# EAGLE design TestAirPollutionFinal (EAGLE 9.6.2)
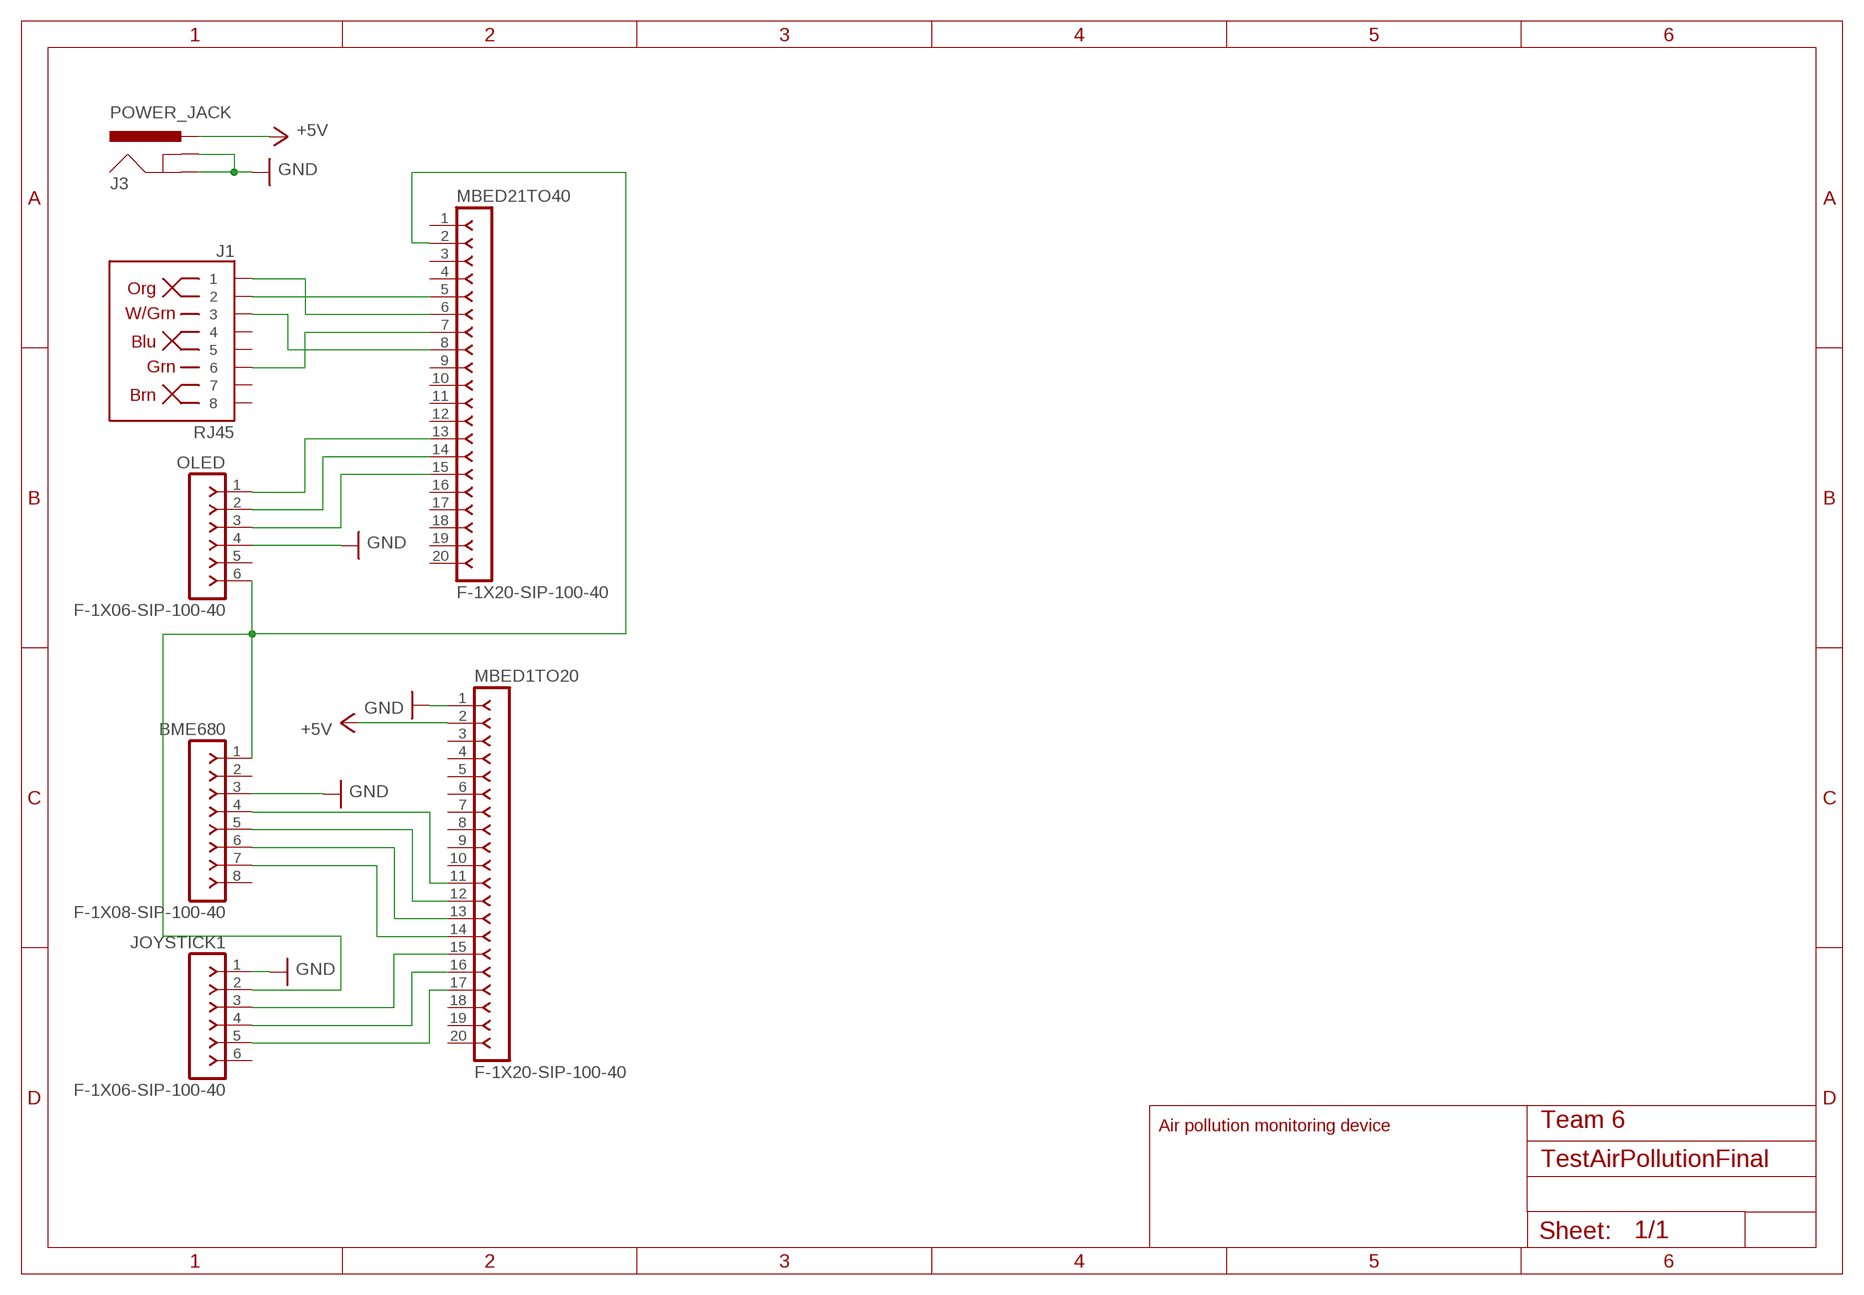
[diagram p0: schematic, sheet 1]

## Parts
BME680  F-1X08-SIP-100-40  [SIP-100-08-40]
J1  RJ45  RJ45-8  [RJ45-8]
J3  POWER_JACK  [POWER_JACK_PTH]
JOYSTICK1  F-1X06-SIP-100-40  [SIP-100-06-40]
MBED1TO20  F-1X20-SIP-100-40  [SIP-100-20-40]
MBED21TO40  F-1X20-SIP-100-40  [SIP-100-20-40]
OLED  F-1X06-SIP-100-40  [SIP-100-06-40]

## Nets
+5V: J3.PWR MBED1TO20.2
CS: BME680.7 MBED1TO20.14
GND: BME680.3 J3.GND J3.GNDBREAK JOYSTICK1.1 MBED1TO20.1 OLED.4
RD+: J1.1 MBED21TO40.6
RD-: J1.2 MBED21TO40.5
RESET: MBED21TO40.15 OLED.3
SCK: BME680.4 MBED1TO20.11
SCLP27: MBED21TO40.14 OLED.2
SDAP28: MBED21TO40.13 OLED.1
SDI: BME680.6 MBED1TO20.13
SDO: BME680.5 MBED1TO20.12
SW: JOYSTICK1.5 MBED1TO20.17
TD+: J1.3 MBED21TO40.8
TD-: J1.6 MBED21TO40.7
VRX: JOYSTICK1.3 MBED1TO20.15
VRY: JOYSTICK1.4 MBED1TO20.16
VU: BME680.1 JOYSTICK1.2 MBED21TO40.2 OLED.6
Unconnected: BME680.2 BME680.8 J1.4 J1.5 J1.7 J1.8 JOYSTICK1.6 MBED1TO20.3 MBED1TO20.4 MBED1TO20.5 MBED1TO20.6 MBED1TO20.7 MBED1TO20.8 MBED1TO20.9 MBED1TO20.10 MBED1TO20.18 MBED1TO20.19 MBED1TO20.20 MBED21TO40.1 MBED21TO40.3 MBED21TO40.4 MBED21TO40.9 MBED21TO40.10 MBED21TO40.11 MBED21TO40.12 MBED21TO40.16 MBED21TO40.17 MBED21TO40.18 MBED21TO40.19 MBED21TO40.20 OLED.5

## Notes on the sheet
- Air pollution monitoring device | Team 6

## Library data of the parts
BME680 = con-headers-jp:F-1X08-: FEMALE HEADER
J1 = SparkFun-Connectors:RJ45-8: RJ45 Jack - 8 pin Simple RJ45, 8-pin connection. Commonly used for Cat5, Cat5e, and Cat6 Ethernet cables. Here is the connector we sell at SparkFun: RJ45 8-Pin Connector <https://www.sparkfun.com/products/643> (PRT-00643) Datasheet <https://cdn.sparkfun.com/datasheets/Prototyping/04908.pdf> It is used on this SparkFun product: SparkFun RJ45 Breakout <https://www.sparkfun.com/products/716> (BOB-00716) Note, you may also be interested in the "MAGJACK" version of this. It is basically a RJ45 connector, but also has some status LEDs built into the connector housing. You can check that out in this library at the device named "MAGJACK.dev" and see these products online: RJ45 Ethernet MagJack-Compatible <https://www.sparkfun.com/products/8534> (PRT-08534) SparkFun RJ45 MagJack Breakout <https://www.sparkfun.com/products/13021> (BOB-13021); PROD_ID: CONN-08506; SF_ID: PRT-00643
J3 = SparkFun-Connectors:POWER_JACK: Power Jack Connector This is the standard 5.5mm barrel jack for power. The PTH is the most common, proven, reliable, footprint. The Slot footprint only works if the mill layer is transmitted to the PCB fab house so be warned. Here are the connectors we sell at SparkFun: DC Barrel Power Jack/Connector <https://www.sparkfun.com/products/119> (PRT-00119) DC Barrel Power Jack/Connector (SMD) <https://www.sparkfun.com/products/12748> (PRT-12748) DC Barrel Jack Adapter - Breadboard Compatible <https://www.sparkfun.com/products/10811> (PRT-10811) It is used on this SparkFun product (and many, many others): SparkFun RedBoard - Programmed with Arduino <https://www.sparkfun.com/products/12757> (DEV-12757) Also, if you need a mating power supply or connector, please check these out: Wall Adapter Power Supply - 9VDC 650mA <https://www.sparkfun.com/products/298> (TOL-00298) DC Barrel Jack Adapter - Male <https://www.sparkfun.com/products/10287> (PRT-10287); PROD_ID: CONN-08197
JOYSTICK1 OLED = con-headers-jp:F-1X06-: FEMALE HEADER
MBED1TO20 MBED21TO40 = con-headers-jp:F-1X20-: FEMALE HEADER

## Board
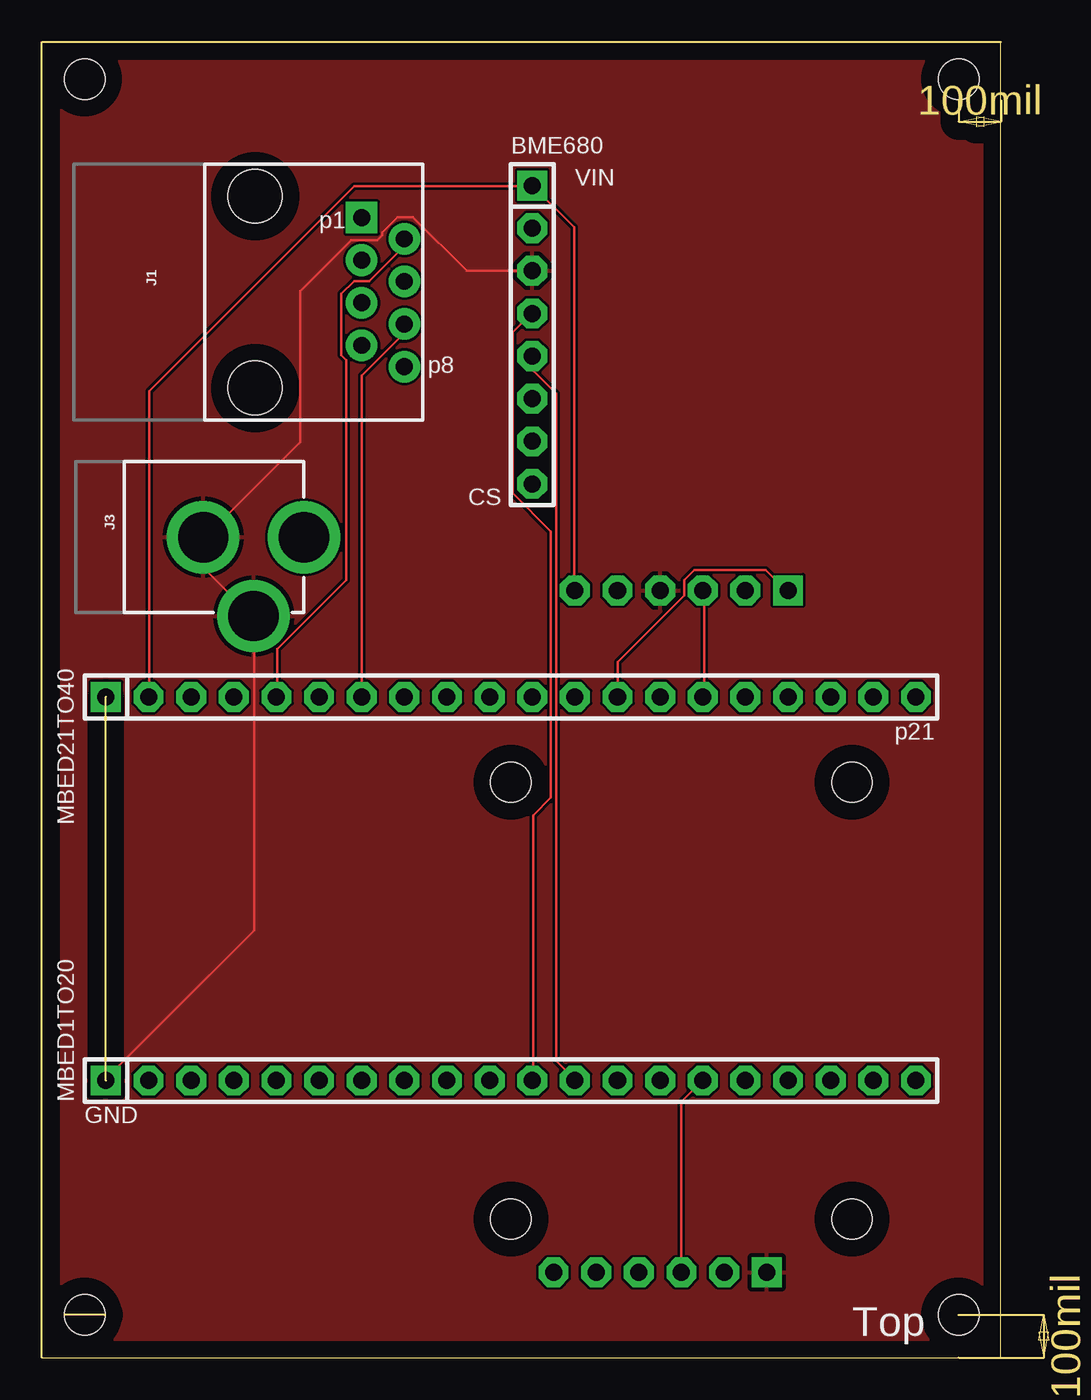
[diagram p1: board, top side]
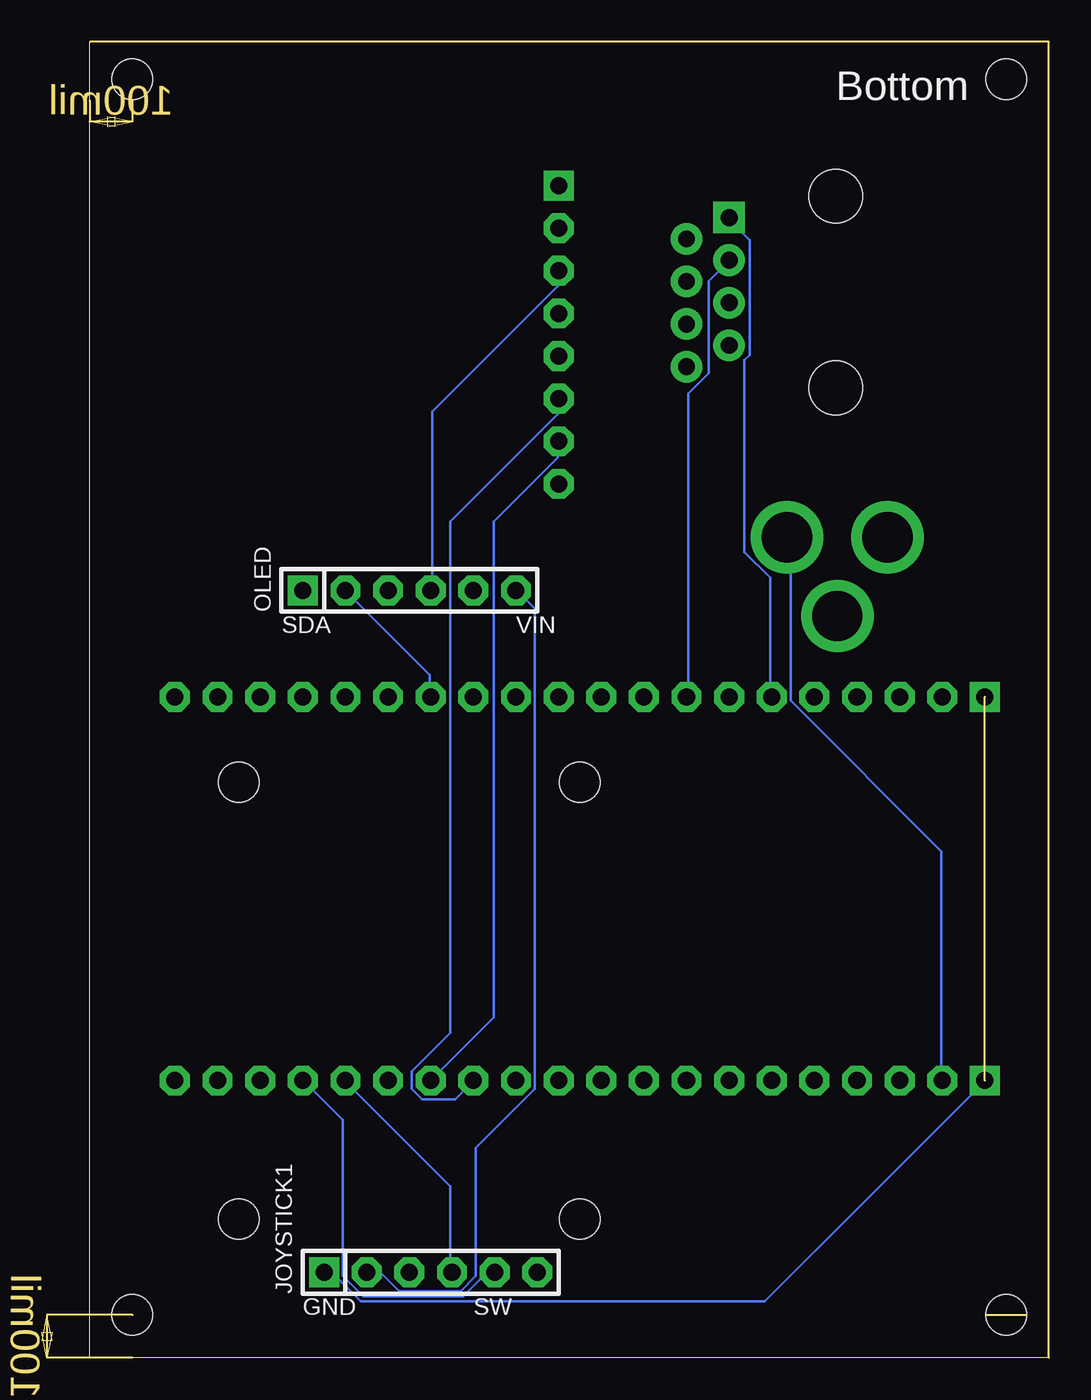
[diagram p2: board, bottom side, seen from below]

Size 57.13 x 78.41 mm. Coordinates in mm from the lower left corner, seen from the top.
Outline: 0,0 57.13,0 57.13,78.41 0,78.41 0,0
Copper layers (1*16): Top 0.035mm / dielectric 1.5mm / Bottom 0.035mm
Design rules "default": minimum track width 6mil, minimum drill 0.35mm, track to track 6mil, track to pad 6mil, pad to pad 6mil, via to via 6mil, smd to smd 6mil, copper to edge 40mil, drill to drill 6mil, minimum pad ring 10mil, minimum via ring 8mil, stop-mask expansion 4mil, vias tented up to drill 0mil, thermal gap 10mil
Holes 2.4 mm at 2.54,2.54 2.54,76.2 27.94,34.29 48.26,34.29 48.26,8.26 27.94,8.26 54.61,76.2 54.61,2.54

### Footprints (pad centres in the part's own frame; a part is rotated, then mirrored left to right if it is on the bottom)
SIP-100-08-40 = drill 1.016 pad 1.778 square: 1 -8.89,0 | drill 1.016 pad 1.778 octagon: 2 -6.35,0; 3 -3.81,0; 4 -1.27,0; 5 1.27,0; 6 3.81,0; 7 6.35,0; 8 8.89,0
RJ45-8 = drill 1 pad 1.88 square: 1 -4.445,6.35 | drill 1 pad 1.88: 2 -3.175,8.89; 3 -1.905,6.35; 4 -0.635,8.89; 5 0.635,6.35; 6 1.905,8.89; 7 3.175,6.35; 8 4.445,8.89 | hole 3.2: -5.715,0; 5.715,0
POWER_JACK_PTH = drill 2.997 pad 4.318: GND 0,7.7; GNDBREAK 4.7,10.7; PWR 0,13.7
SIP-100-06-40 = drill 1.016 pad 1.778 square: 1 -6.35,0 | drill 1.016 pad 1.778 octagon: 2 -3.81,0; 3 -1.27,0; 4 1.27,0; 5 3.81,0; 6 6.35,0
SIP-100-20-40 = drill 1.016 pad 1.778 square: 1 -24.13,0 | drill 1.016 pad 1.778 octagon: 2 -21.59,0; 3 -19.05,0; 4 -16.51,0; 5 -13.97,0; 6 -11.43,0; 7 -8.89,0; 8 -6.35,0; 9 -3.81,0; 10 -1.27,0; 11 1.27,0; 12 3.81,0; 13 6.35,0; 14 8.89,0; 15 11.43,0; 16 13.97,0; 17 16.51,0; 18 19.05,0; 19 21.59,0; 20 24.13,0

### Placement (x,y rotation side)
BME680  29.21,60.96 270 top
J1  12.7,63.5 270 top
J3  1.91,48.9 270 top
JOYSTICK1  36.83,5.08 0 bottom
MBED1TO20  27.94,16.51 0 top
MBED21TO40  27.94,39.37 0 top
OLED  38.1,45.72 0 bottom

### Tracks (layer width: path | path; a pad name or v marks a point on that pad's centre or on a via)
+5V
  Bottom 0.152: MBED1TO20.2 6.4,16.61 6.4,30.18 15.39,39.17 15.39,48.62 15.54,48.77 J3.PWR
CS
  Bottom 0.152: MBED1TO20.14 33.07,20.27 33.07,49.84 29.26,53.65 29.26,54.56 BME680.7
GND
  Top 0.152: MBED1TO20.1 3.81,16.61 12.65,25.45 12.65,44.04 J3.GNDBREAK 12.5,44.2 9.75,46.94 9.75,48.77 J3.GND 9.75,48.92 15.39,54.56 15.39,63.55 18.44,66.6 19.96,66.6 20.27,66.9 20.27,67.06 21.18,67.97 22.1,67.97 25.3,64.77 BME680.3
  Bottom 0.152: BME680.3 29.26,64.77 29.26,63.86 36.73,56.39 36.73,45.72 OLED.4 | JOYSTICK1.1 43.13,5.03 42.67,5.03 41,3.35 16.92,3.35 3.81,16.46 MBED1TO20.1
  pour Top: 0,0 0,78.74 57.15,78.74 57.15,0
RD+
  Bottom 0.152: MBED21TO40.6 16.61,39.47 16.61,46.48 18.14,48.01 18.14,59.44 17.83,59.74 17.83,66.6 19.05,67.82 J1.1
RD-
  Top 0.152: MBED21TO40.5 14.02,39.47 14.02,42.22 18.14,46.33 18.14,59.44 17.83,59.74 17.83,63.4 18.59,64.16 19.51,64.16 21.49,66.14 21.49,66.6 J1.2
RESET
  Top 0.152: MBED21TO40.15 39.47,39.47 39.47,45.72 OLED.3
SCK
  Top 0.152: MBED1TO20.11 29.26,16.61 29.26,32.31 30.33,33.38 30.33,49.23 28.04,51.51 28.04,61.11 29.11,62.18 BME680.4
SCLP27
  Bottom 0.152: OLED.2 36.88,40.69 36.88,39.47 MBED21TO40.14
SDAP28
  Top 0.152: MBED21TO40.13 34.29,41.45 38.25,45.41 38.25,46.33 38.86,46.94 43.13,46.94 44.35,45.72 OLED.1
SDI
  Bottom 0.152: BME680.6 29.26,57.15 29.26,56.24 35.66,49.84 35.66,19.36 37.95,17.07 37.95,16 37.34,15.39 35.36,15.39 34.29,16.46 MBED1TO20.13
SDO
  Top 0.152: BME680.5 29.26,59.59 29.26,58.83 30.63,57.45 30.63,17.68 31.7,16.61 MBED1TO20.12
SW
  Bottom 0.152: JOYSTICK1.5 33.07,5.03 33.53,5.03 34.9,3.66 40.84,3.66 42.06,4.88 42.06,14.17 44.35,16.46 MBED1TO20.17
TD+
  Bottom 0.152: MBED21TO40.8 21.49,39.47 21.49,57.45 20.27,58.67 20.27,64.16 19.05,65.38 J1.3
TD-
  Top 0.152: MBED21TO40.7 19.05,58.52 21.49,60.96 21.49,61.57 J1.6
VRX
  Top 0.152: JOYSTICK1.3 38.1,15.24 MBED1TO20.15
VRY
  Bottom 0.152: JOYSTICK1.4 35.66,5.18 35.66,10.21 41.91,16.46 MBED1TO20.16
VU
  Top 0.152: MBED21TO40.2 6.4,39.47 6.4,57.61 18.59,69.8 29.11,69.8 BME680.1 31.7,67.36 31.7,45.72 OLED.6
  Bottom 0.152: JOYSTICK1.2 40.54,5.03 39.78,5.03 38.71,3.96 35.05,3.96 34.14,4.88 34.14,12.5 30.63,16 30.63,44.65 31.7,45.72 OLED.6

### Text on the board
tPlace: VIN | p1 | p8 | CS | p21 | GND | Top
bPlace: Bottom | VIN | SDA | SW | GND